# EAGLE schematic CABLE 1 (EAGLE 9.3.0)
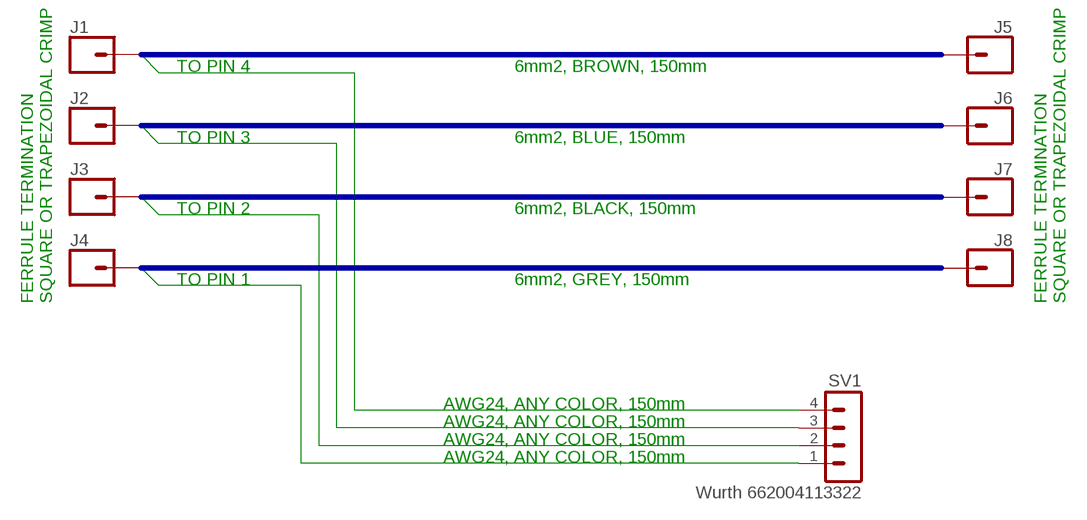
[diagram p0: schematic, sheet 1]

## Parts
J1  CONN_01  [1X01]
J2  CONN_01  [1X01]
J3  CONN_01  [1X01]
J4  CONN_01  [1X01]
J5  CONN_01  [1X01]
J6  CONN_01  [1X01]
J7  CONN_01  [1X01]
J8  CONN_01  [1X01]
SV1  Wurth 662004113322  MA04-1  [MA04-1]

## Nets
N$1: J1.1 SV1.4
N$2: J2.1 SV1.3
N$3: J3.1 SV1.2
N$4: J4.1 SV1.1
Unconnected: J5.1 J6.1 J7.1 J8.1

## Buses
B$1
B$2
B$3
B$4

## Notes on the sheet
- TO PIN 4 | 6mm2, BROWN, 150mm
- TO PIN 3 | 6mm2, BLUE, 150mm
- TO PIN 2 | 6mm2, BLACK, 150mm
- TO PIN 1 | 6mm2, GREY, 150mm
- FERRULE TERMINATION
  SQUARE OR TRAPEZOIDAL CRIMP
- FERRULE TERMINATION
  SQUARE OR TRAPEZOIDAL CRIMP
- AWG24, ANY COLOR, 150mm
- AWG24, ANY COLOR, 150mm
- AWG24, ANY COLOR, 150mm
- AWG24, ANY COLOR, 150mm

## Library data of the parts
J1-J8 = SparkFun-Connectors:CONN_01: Single connection point. Often used as Generic Header-pin footprint for 0.1 inch spaced/style header connections On any of the 0.1 inch spaced packages, you can populate with these: Break Away Headers - Straight <https://www.sparkfun.com/products/116> (PRT-00116) Break Away Male Headers - Right Angle <https://www.sparkfun.com/products/553> (PRT-00553) Female Headers <https://www.sparkfun.com/products/115> (PRT-00115) Break Away Headers - Machine Pin <https://www.sparkfun.com/products/117> (PRT-00117) Break Away Female Headers - Swiss Machine Pin <https://www.sparkfun.com/products/743> (PRT-00743) This device is also useful as a general connection point to wire up your design to another part of your project. Our various solder wires solder well into these plated through hole pads. Hook-Up Wire - Assortment (Stranded, 22 AWG) <https://www.sparkfun.com/products/11375> (PRT-11375) Hook-Up Wire - Assortment (Solid Core, 22 AWG) <https://www.sparkfun.com/products/11367> (PRT-11367) View the entire wire category on our website here <https://www.sparkfun.com/categories/141> Special notes: SMTSO-256-ET is a "flush mount" nut for a 4-40 screw. We mostly use this on specialty testbeds; it is a nice way to connect hardware to your PCB at an adjustable hieght. Also note, the SNAP packages are for using a snappable style connector. We sell a baggie of snaps and they are also used on two LilyPad designs: Snap Assortment - 30 pack (male and female) <https://www.sparkfun.com/products/11347> (DEV-11347) LilyPad Arduino SimpleSnap <https://www.sparkfun.com/products/10941> (DEV-10941) LilyPad SimpleSnap Protoboard <https://www.sparkfun.com/products/10940> (DEV-10940)
SV1 = con-lstb:MA04-1: PIN HEADER; OC_FARNELL: unknown; OC_NEWARK: unknown